# EAGLE design ADE-25_13cm (EAGLE 9.6.2)
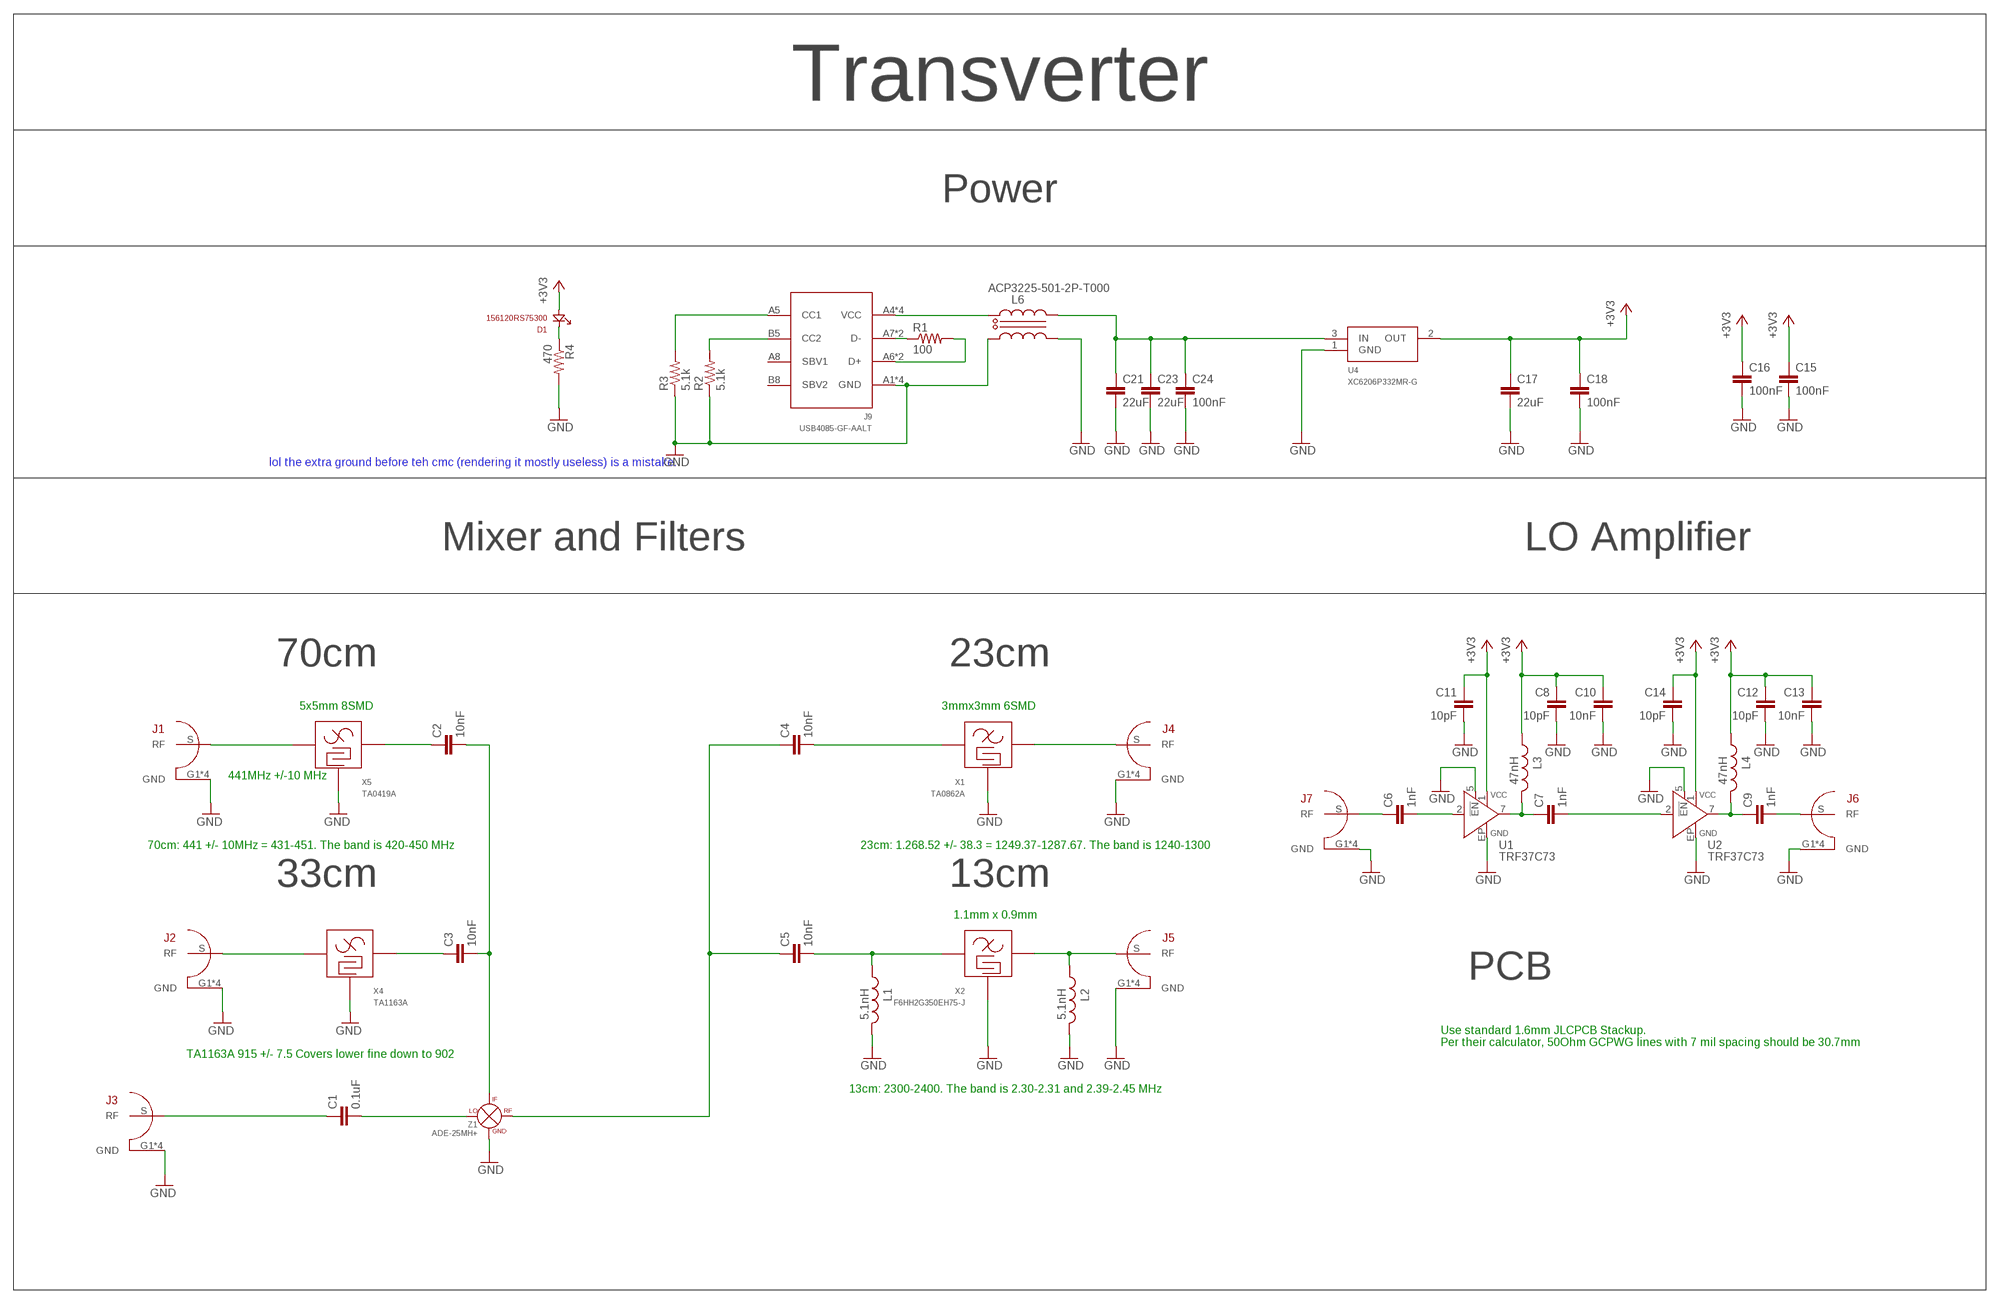
[diagram p0: schematic, sheet 1]

## Parts
C1  0.1uF  0603_CAPACITOR  [0603]
C2  10nF  0603_CAPACITOR  [0603]
C3  10nF  0603_CAPACITOR  [0603]
C4  10nF  0603_CAPACITOR  [0603]
C5  10nF  0603_CAPACITOR  [0603]
C6  1nF  0603_CAPACITOR  [0603]
C7  1nF  0603_CAPACITOR  [0603]
C8  10pF  0402_CAPACITOR  [0402_INDUCTOR]
C9  1nF  0603_CAPACITOR  [0603]
C10  10nF  0402_CAPACITOR  [0402_INDUCTOR]
C11  10pF  0402_CAPACITOR  [0402_INDUCTOR]
C12  10pF  0402_CAPACITOR  [0402_INDUCTOR]
C13  10nF  0402_CAPACITOR  [0402_INDUCTOR]
C14  10pF  0402_CAPACITOR  [0402_INDUCTOR]
C15  100nF  0603_CAPACITOR  [0603]
C16  100nF  0603_CAPACITOR  [0603]
C17  22uF  C-EUC1206  [C1206]
C18  100nF  0603_CAPACITOR  [0603]
C21  22uF  C-EUC1206  [C1206]
C23  22uF  C-EUC1206  [C1206]
C24  100nF  0603_CAPACITOR  [0603]
D1  156120RS75300  [1206_REV]
J1  0733910070  [CONREVSMA008-G]
J2  0733910070  [CONREVSMA008-G]
J3  0733910070  [CONREVSMA008-G]
J4  0733910070  [CONREVSMA008-G]
J5  0733910070  [CONREVSMA008-G]
J6  0733910070  [CONREVSMA008-G]
J7  0733910070  [CONREVSMA008-G]
J9  USB4085-GF-AALT  [USBC2]
L1  5.1nH  0402_INDUCTOR  [0402_INDUCTOR]
L2  5.1nH  0402_INDUCTOR  [0402_INDUCTOR]
L3  47nH  0402_INDUCTOR  [0402_INDUCTOR]
L4  47nH  0402_INDUCTOR  [0402_INDUCTOR]
L6  ACP3225-501-2P-T000  [3225]
R1  100  0603_RESISTOR  [0603]
R2  5.1k  0603_RESISTOR  [0603]
R3  5.1k  0603_RESISTOR  [0603]
R4  470  0603_RESISTOR  [0603]
U1  TRF37C73  [8WSON2X2]
U2  TRF37C73  [8WSON2X2]
U4  XC6206P332MR-G  [SOT23-3_CENTERED]
X1  TA0862A  [TA0862A]
X2  F6HH2G350EH75-J  [EH75]
X4  TA1163A  TA0862A  [TA0862A]
X5  TA0419A  [TAO419]
Z1  ADE-25MH+  [CD]

## Nets
1I: C4.2 X1.B
1O: J4.S(RF) X1.E
2I: C5.2 L1.P$1 X2.1
2O: J5.S(RF) L2.P$1 X2.4
70BI: C3.1 X4.B
70BO: J2.S(RF) X4.E
+3V3: C8.P$1 C10.P$1 C11.P$1 C12.P$1 C13.P$1 C14.P$1 C15.1 C16.1 C17.1 C18.1 D1.A L3.P$1 L4.P$1 U1.1(+VS) U2.1(+VS) U4.2(OUT)
+5V1: C21.1 C23.1 C24.1 L6.4(1OUT) U4.3(IN)
GND: C8.P$2 C10.P$2 C11.P$2 C12.P$2 C13.P$2 C14.P$2 C15.2 C16.2 C17.2 C18.2 C21.2 C23.2 C24.2 J1.G1(GND) J1.G2(GND) J1.G3(GND) J1.G4(GND) J2.G1(GND) J2.G2(GND) J2.G3(GND) J2.G4(GND) J3.G1(GND) J3.G2(GND) J3.G3(GND) J3.G4(GND) J4.G1(GND) J4.G2(GND) J4.G3(GND) J4.G4(GND) J5.G1(GND) J5.G2(GND) J5.G3(GND) J5.G4(GND) J6.G1(GND) J6.G2(GND) J6.G3(GND) J6.G4(GND) J7.G1(GND) J7.G2(GND) J7.G3(GND) J7.G4(GND) J9.A1(GND) J9.A12(GND) J9.B1(GND) J9.B12(GND) L1.P$2 L2.P$2 L6.2(2IN) L6.3(2OUT) R2.1 R3.1 R4.2 U1.5(!EN) U1.EP(-VS) U2.5(!EN) U2.EP(-VS) U4.1(GND) X1.A(GND) X1.C(GND) X1.D(GND) X1.F(GND) X2.2(GND) X2.3(GND) X2.5(GND) X4.A(GND) X4.C(GND) X4.D(GND) X4.F(GND) X5.1(GND) X5.3(GND) X5.4(GND) X5.5(GND) X5.7(GND) X5.8(GND) Z1.1(GND) Z1.4(GND) Z1.5(GND)
IN1: C6.2 U1.2(IN)
IN2: C7.2 U2.2(IN)
N$1: C1.1 J3.S(RF)
N$2: C1.2 Z1.6(LO)
N$3: C2.1 X5.2
N$4: C2.2 C3.2 Z1.2(IF)
N$5: C4.1 C5.1 Z1.3(RF)
N$7: J9.A7(D-) J9.B7(D-) R1.1
N$8: J9.A6(D+) J9.B6(D+) R1.2
N$10: J9.B5(CC2) R2.2
N$11: J9.A5(CC1) R3.2
N$13: D1.K R4.1
N$15: J9.A4(VCC) J9.A9(VCC) J9.B4(VCC) J9.B9(VCC) L6.1(1IN)
N$17: C6.1 J7.S(RF)
N$18: C9.2 J6.S(RF)
N$21: J1.S(RF) X5.6
OUT1: C7.1 L3.P$2 U1.7(OUT)
OUT2: C9.1 L4.P$2 U2.7(OUT)
Unconnected: J9.A8(SBV1) J9.B8(SBV2)

## Notes on the sheet
- Transverter
- Power
- lol the extra ground before teh cmc (rendering it mostly useless) is a mistake.
- Mixer and Filters | LO Amplifier
- 70cm | 23cm
- 5x5mm 8SMD | 3mmx3mm 6SMD
- 441MHz +/-10 MHz
- 70cm: 441 +/- 10MHz = 431-451. The band is 420-450 MHz | 23cm: 1.268.52 +/- 38.3 = 1249.37-1287.67. The band is 1240-1300
- 33cm | 13cm
- 1.1mm x 0.9mm
- PCB
- Use standard 1.6mm JLCPCB Stackup.
  Per their calculator, 50Ohm GCPWG lines with 7 mil spacing should be 30.7mm
- TA1163A 915 +/- 7.5 Covers lower fine down to 902
- 13cm: 2300-2400. The band is 2.30-2.31 and 2.39-2.45 MHz

## Library data of the parts
C1-C7 C9 C15 C16 C18 C24 = ruark2:0603_CAPACITOR: 0603 Capacitor -- WARNING: NO DEFINED VALUE OR PART NUMBER; VALUE: sel
C8 C10-C14 = ruark2:0402_CAPACITOR: 0402 select capacitor; VALUE: sel
C17 C21 C23 = rcl:C-EU: CAPACITOR, European symbol; SPICEPREFIX: C
D1 = ruark2:156120RS75300: Red 624nm LED Indication - Discrete 2V 1206 Reverse Mount (3216 Metric); PARTNO: 732-5031-1-ND
J1-J7 = ruark2:0733910070: SMA Connector Receptacle, Female Socket 50Ohm Through Hole Solder; PARTNO: WM5544-ND
J9 = ruark2:USB4085-GF-A: USB - C USB 2.0 Receptacle Connector 16 Position Through Hole, Right Angle
L1-L4 = ruark2:0402_INDUCTOR: select; VALUE: SEL
L6 = ruark2:ACP3225-501-2P-T000: 2 Line Common Mode Choke Surface Mount 500 Ohms @ 100 MHz 2A DCR 40mOhm (Typ); PARTNO: 445-172408-1-ND
R1-R4 = ruark2:0603_RESISTOR: 0603 Resistor -- WARNING: NO DEFINED PART NUMBER OR VALUE; VALUE: sel
U1 U2 = TRF37C73:TRF37C73
U4 = ruark2:XC6206P332MR-G: 200mA Fixed 3.3V Positive electrode 6V SOT-23-3L Voltage Regulators - Linear, Low Drop Out (LDO) Regulators ROHS; JLC: C5446
X1 X4 = ruark2:TA0862A: 1.26852GHz Frequency Wireless RF SAW Filter (Surface Acoustic Wave) 3.2dB 20.46MHz Bandwidth 6-SMD, No Lead; PARTNO: 4606-TA0862ACT-ND
X2 = ruark2:F6HH2G350EH75-J: 2.35GHz Frequency LTE, SCDMA RF SAW Filter (Surface Acoustic Wave) 1.4dB Bandwidth 5-SMD, No Lead; PARTNO: 587-F6HH2G350EH75-JCT-ND
X5 = ruark2:TA0419A: 441MHz Frequency General Purpose RF SAW Filter (Surface Acoustic Wave) 1.5dB 19MHz Bandwidth 8-SMD, No Lead; PARTNO: 4606-TA0419ACT-ND
Z1 = ruark2:ADE-25MH+: SMT Triple Balanced Mixer, RF/LO Freq 5 - 2500 MHz; PARTNO: 3157-ADE-25MH+CT-ND

## Board
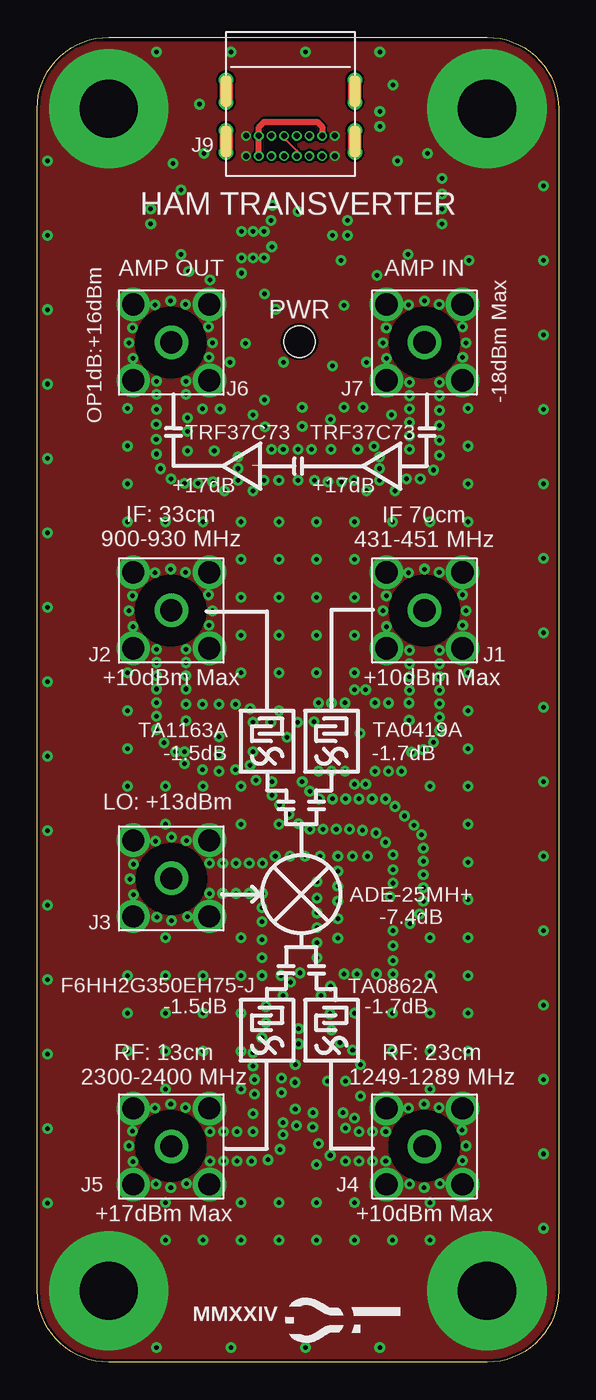
[diagram p1: board, top side]
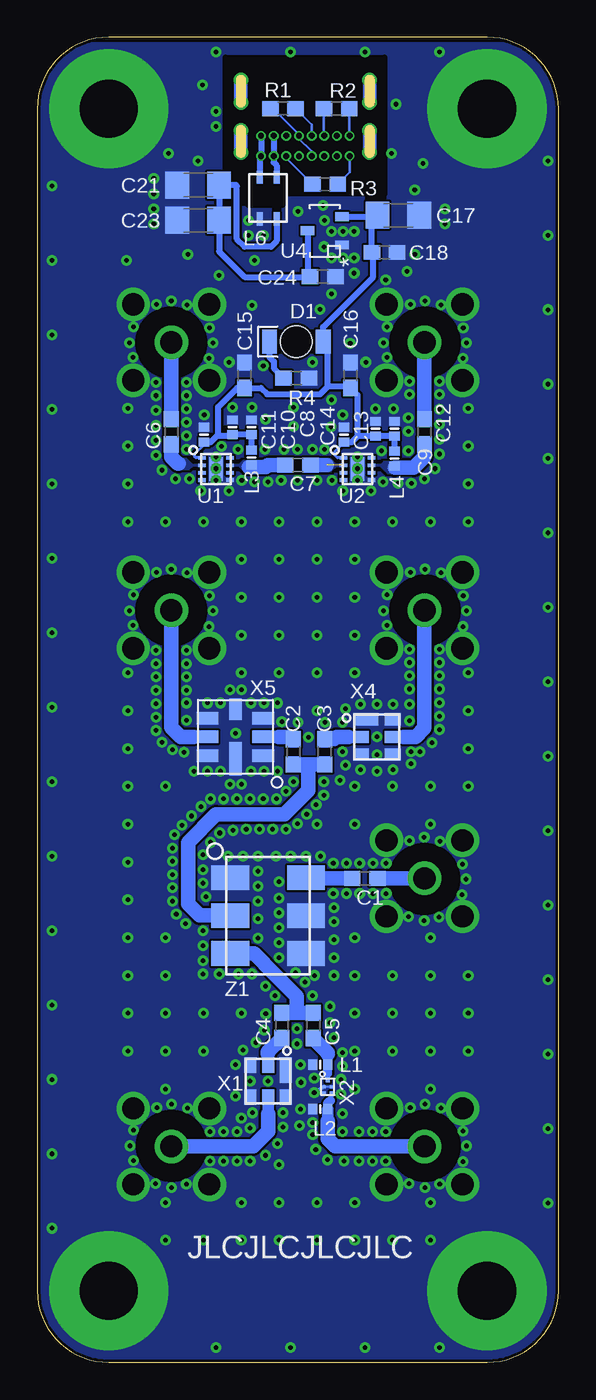
[diagram p2: board, bottom side, seen from below]

Size 35 x 89 mm. Coordinates in mm from the lower left corner, seen from the top.
Outline: 30.2,0 4.8,0 arc-90 0,4.8 0,84.2 arc-90 4.8,89 30.2,89 arc-90 35,84.2 35,4.8 arc-90 30.2,0
Copper layers (1*16): Top 0.035mm / dielectric 1.5mm / Bottom 0.035mm
Design rules "default *": minimum track width 5mil, minimum drill 12mil, track to track 6mil, track to pad 6mil, pad to pad 6mil, via to via 6mil, smd to smd 6mil, copper to edge 0.2mm, drill to drill 6mil, minimum pad ring 5mil, minimum via ring 8mil, stop-mask expansion 4mil, vias tented up to drill 12mil, thermal gap 10mil
tRestrict: area 23.7,48.2 to 28.3,52.8; area 6.7,48.2 to 11.2,52.8; area 6.7,30.2 to 11.3,34.7; area 6.7,12.3 to 11.3,16.8; area 23.7,12.3 to 28.3,16.8; area 6.7,12.3 to 11.3,16.8; area 23.7,66.2 to 28.3,70.8; area 6.7,66.2 to 11.2,70.8
bRestrict: area 23.7,48.2 to 28.3,52.8; area 6.7,48.2 to 11.2,52.8; area 6.7,30.2 to 11.3,34.7; area 6.7,12.3 to 11.3,16.8; area 23.7,12.3 to 28.3,16.8; area 6.7,12.3 to 11.3,16.8; area 23.7,66.2 to 28.3,70.8; area 6.7,66.2 to 11.2,70.8; area 17.2,40.8 to 18.4,41.2; area 15.1,40.8 to 16.3,41.2; area 18,22.4 to 19.2,22.8; area 15.9,22.4 to 17.1,22.8; 3 more areas

### Footprints (pad centres in the part's own frame; a part is rotated, then mirrored left to right if it is on the bottom)
0603 = smd 1.1 x 1: 1 -0.85,0; 2 0.85,0
0402_INDUCTOR = smd 0.6 x 0.7: P$1 0.5,0; P$2 -0.5,0
C1206 = smd 1.6 x 1.8: 1 -1.4,0; 2 1.4,0
1206_REV = smd 1 x 1.6: A -1.8,0; K 1.8,0 | hole 2.1: 0,0
CONREVSMA008-G = drill 1.499: G1 -2.553,2.553; G2 2.553,2.553; G3 2.553,-2.553; G4 -2.553,-2.553; S 0,0
USBC2 = drill 0.4 pad 0.65: A1 -2.975,0.98; A4 -2.125,0.98; A5 -1.275,0.98; A6 -0.425,0.98; A7 0.425,0.98; A8 1.275,0.98; A9 2.125,0.98; A12 2.975,0.98; B1 2.975,-0.37; B4 2.125,-0.37; B5 1.275,-0.37; B6 0.425,-0.37; B7 -0.425,-0.37; B8 -1.275,-0.37; B9 -2.125,-0.37; B12 -2.975,-0.37 | drill 0.65 pad 0.9: P$1 -4.325,0.75; P$2 4.325,0.75; P$3 4.325,-0.75; P$4 -4.325,-2.63; P$5 -4.325,-0.75; P$6 -4.325,-4.13; P$7 4.325,-2.63; P$8 4.325,-4.13
3225 = smd 0.9 x 0.4: 1 -1.4,0.575; 2 -1.4,-0.575; 3 1.4,-0.575; 4 1.4,0.575
8WSON2X2 = smd 0.5 x 0.25: 1 -0.95,0.75; 2 -0.95,0.25; 3 -0.95,-0.25; 4 -0.95,-0.75; 5 0.95,-0.75; 6 0.95,-0.25; 7 0.95,0.25; 8 0.95,0.75 | smd 0.9 x 1.6: EP 0,0
SOT23-3_CENTERED = smd 0.6 x 0.9: 1 -0.95,-1.15; 2 0.95,-1.15; 3 0,1.15
TA0862A = smd 0.81 x 1.7: A -1.191,-0.745 | smd 0.81 x 1.05: B 0,-1.07; C 1.19,-1.07; D 1.19,1.07; E 0,1.07; F -1.19,1.07
EH75 = smd 0.2 x 0.25: 1 -0.395,0; 2 0,-0.25; 3 0.395,-0.25; 4 0.395,0.25; 5 0,0.25
TAO419 = smd 0.84 x 1.47: 1 -1.27,-1.865; 2 0,-1.865; 3 1.27,-1.865; 5 1.27,1.865; 6 0,1.865; 7 -1.27,1.865 | smd 1.47 x 0.84: 4 1.865,0 | smd 2.28 x 0.84: 8 -1.46,0
CD = smd 1.651 x 2.54: 1 -2.54,-2.54; 2 0,-2.54; 3 2.54,-2.54; 4 2.54,2.54; 5 0,2.54; 6 -2.54,2.54

### Placement (x,y rotation side)
C1  13,32.5 180 bottom
C2  17.8,41 270 bottom
C3  15.7,41 270 bottom
C4  18.58,22.62 270 bottom
C5  16.48,22.62 270 bottom
C6  26,62.5 270 bottom
C7  17.5,60.25 0 bottom
C8  20.6,62.8 270 bottom
C9  9,62.5 90 bottom
C10  21.9,62.8 270 bottom
C11  23.8,62.3 270 bottom
C12  11,62.7 270 bottom
C13  12.3,62.7 270 bottom
C14  14.4,62.3 270 bottom
C15  21.08,66.29 90 bottom
C16  13.97,66.29 90 bottom
C17  10.76,77.04 0 bottom
C18  11.68,74.55 0 bottom
C21  24.19,79.07 180 bottom
C23  24.19,76.71 180 bottom
C24  15.83,72.92 0 bottom
D1  17.61,68.55 180 bottom
J1  26,50.5 270 top
J2  9,50.5 270 top
J3  9,32.5 0 top
J4  26,14.5 180 top
J5  9,14.5 180 top
J6  9,68.5 180 top
J7  26,68.5 180 top
J9  17,82 180 top
L1  16,20 0 bottom
L2  16,17 0 bottom
L3  20.6,60.77 90 bottom
L4  11,60.7 90 bottom
L6  19.5,78.2 270 bottom
R1  18.5,84.2 0 bottom
R2  14.9,84.2 180 bottom
R3  15.67,79.12 180 bottom
R4  17.61,66.1 0 bottom
U1  23,60 0 bottom
U2  13.5,60 0 bottom
U4  15.7,76 90 bottom
X1  19.5,18.88 180 bottom
X2  15.5,18.5 270 bottom
X4  12.2,42 270 bottom
X5  21.7,42 90 bottom
Z1  19.5,30 270 bottom

### Tracks (layer width: path | path; a pad name or v marks a point on that pad's centre or on a via)
1I
  Bottom 0.254: X1.B 19.5,20.83 19.51,20.84
  Bottom 0.965: C4.2 19.51,20.84 19.51,20.7
1O
  Bottom 0.78: 19.5,16.7 X1.E
  Bottom 0.965: J4.S 20.5,14.5 19.5,15.5 19.5,16.7
2I
  Bottom 0.2: X2.1 15.5,19.4
  Bottom 0.254: L1.P$1 15.5,20.72
  Bottom 0.6: 15.5,19.4 L1.P$1
  Bottom 0.965: C5.2 15.5,20.79 15.5,20.72 15.49,20.71
2O
  Bottom 0.2: X2.4 15.25,17.84 15.25,17.65
  Bottom 0.254: 15.25,17.84 15.5,17.4
  Bottom 0.6: L2.P$1 15.5,17.4 15.32,17.58
  Bottom 0.78: 15.5,16.2 L2.P$1
  Bottom 0.965: J5.S 15,14.5 15.5,15 15.5,16.08 | 15.5,16.08 15.49,16.09 | 15.5,16.08 15.5,16.2
70BI
  Bottom 0.78: 15.55,42 C3.1
  Bottom 0.8: 14.1,42 X4.B
  Bottom 0.965: C3.1 15.05,41.85 14.9,42 14.1,42
70BO
  Bottom 0.78: 10.4,42 X4.E
  Bottom 0.965: J2.S 9,42.6 9.6,42 10.4,42
+3V3
  Bottom 0.2: U1.1 24.35,60.75 24.43,60.83 24.43,61.02 23.8,61.65 C11.P$1 | U2.1 14.85,60.75 15,60.9 15,61.2 C14.P$1
  Bottom 0.406: C11.P$1 23.35,61.8 22.91,62.24 | 22.91,62.24 21.96,62.24 C10.P$1 C8.P$1 L3.P$1 | L4.P$1 C12.P$1 C13.P$1 13.49,62.2 | C14.P$1 13.89,61.8 13.49,62.2 | 22.91,62.24 22.86,62.29 22.86,64.16 21.57,65.44 C15.1 19.98,65.44 19.56,65.02 16,65.02 15.49,65.53 | U4.2 12.7,76.95 | 12.7,76.95 12.25,76.95 C17.1 | 12.7,76.95 12.53,76.78 C18.1 12.45,74.46 12.45,72.9 15.81,69.54 D1.A 15.49,68.24 15.49,65.53 | 13.49,62.2 13.49,64.97 C16.1 14.06,65.53 15.49,65.53
+5V1
  Bottom 0.406: L6.4 18.93,75.31 19.3,74.93 21.08,74.93 21.59,75.44 21.59,78.99 21.66,79.07 C21.1 C23.1 22.79,74.61 21.08,72.9 16.7,72.9 C24.1 16.85,73.08 U4.3
GND  (via drill 0.3, 3.9 pad 8)
  Bottom 0.127: X2.5 X2.2
  Bottom 0.152: R3.1 14.03,79.92 J9.A12 | R2.1 14.05,82.39 J9.B1
  Bottom 0.254: X2.2 v16.4,18.1
  Bottom 0.406: J9.B12 J9.A1 20.07,80.92 L6.2
  other vias: 28.8,50.48 28.57,49.49 28.54,51.55 27.02,47.82 27.02,46.93 24.99,47.82 24.99,46.93 26,53.28 26.99,53.05 24.94,53.02 23.21,50.48 23.44,51.47 23.46,49.42 25.15,40.98 24.98,43.12 21.67,42.25 24.97,44.28 22.69,44.28 23.58,44.28 23.58,39.71 22.69,39.71 24.47,39.71 18.88,39.71 20.66,39.71 19.77,39.71 19.77,44.28 20.66,44.28 18.88,44.28 21.29,38.82 22.05,38.82 21.29,45.17 22.05,45.17 11.76,50.48 11.53,49.49 11.5,51.55 10,47.9 10,47 8,47.9 8,47 8.96,53.28 9.95,53.05 7.9,53.02 6.17,50.48 6.4,51.47 6.42,49.42 9.3,41 10,43.1 9.9,41 10,44.2 11.1,44.2 12.2,44.2 13.3,44.2 9.9,40.2 11.1,39.8 12.2,40.8 13.3,39.8 14.5,43 14.5,41 14.3,40.1 14.3,43.9 9.02,35.26 10.01,35.03 7.95,35 6.22,32.46 6.45,33.45 6.48,31.4 9.02,29.67 8.03,29.9 10.08,29.92 25.98,11.74 24.99,11.97 27.05,12 23.4,13.5 22.5,13.5 23.4,15.5 22.5,15.5 28.78,14.54 28.55,13.55 28.52,15.6 25.98,17.33 26.97,17.1 24.92,17.08 20.7,13.5 21.6,13.5 21.6,15.5 20.7,15.73 8.96,17.33 9.96,17.1 7.9,17.08 11.6,15.5 12.5,15.5 11.6,13.5 12.5,13.5 6.17,14.54 6.4,15.53 6.42,13.47 8.96,11.74 7.97,11.97 10.03,12 13.4,15.5 13.4,13.5 16.5,15.3 14.5,20.8 16.5,16.1 14.5,15.5 17.33,20 16.4,19.1 17.32,17 14.5,19.9 14.6,19 14.6,18 14.5,16.7 4.8,4.8 30.2,4.8 30.2,84.2 4.8,84.2 0.7,80.7 0.7,75.7 0.7,70.7 0.7,65.7 0.7,60.7 0.7,55.7 0.7,50.7 0.7,45.7 0.7,40.7 0.7,35.7 0.7,30.7 0.7,25.7 0.7,20.7 0.7,15.7 0.7,10.7 15.7,76.7 20.83,76.7 8,1 34,9 13,1 18,1 23,1 34,14 34,19 34,24 34,29 34,34 34,39 34,44 34,49 34,54 34,59 34,64 34,69 34,79 34,74 8,88 23,84 27.02,44.24 27.02,43.34 27.02,42.44 26.62,41.64 25.92,41.14 18.58,43.01 16.78,41.98 17.48,42.98 15.68,42.98 14.68,39.08 8,44.3 8,43.4 8,42.5 8.5,41.6 12.2,39.7 23.68,31.28 23.88,32.18 21.85,35.72 22.18,33.98 21.18,33.98 20.18,33.98 18.98,33.98 17.98,33.98 23.88,28.98 23.88,27.98 23.88,26.98 23.88,26.08 22.78,26.08 21.48,26.08 18.78,27.18 18.78,28.18 18.78,29.18 18.78,30.18 18.78,31.18 18.78,32.28 20.18,32.98 20.18,31.98 20.18,30.98 20.18,29.78 20.18,28.48 15.98,33.98 15.08,30.53 15.08,29.58 15.08,28.38 15.08,27.18 15.08,25.98 16.38,25.98 15.36,23.9 17.56,22.4 15.36,22.8 19.05,24.63 19.66,23.4 19.76,22.3 19.67,13.9 18.87,14.7 18.5,15.8 19.5,18.88 20.7,18.88 21.3,16.4 21.7,17.88 21.7,19.98 21.19,20.98 17.3,18.8 17.4,15.9 14.4,13.5 15.5,13.6 16.3,14.3 12.2,42.02 28.8,68.48 28.57,67.49 28.54,69.55 27.02,65.82 27.02,64.93 24.99,65.82 24.99,64.93 26,71.28 26.99,71.05 24.94,71.02 23.21,68.48 23.44,69.47 23.46,67.42 11.76,68.48 11.53,67.49 11.5,69.55 10,65.9 10,65 8,65.9 8,65 8.96,71.28 9.95,71.05 7.9,71.02 6.17,68.48 6.4,69.47 6.42,67.42 11.2,81.2 26.2,81.2 22.99,60.03 22.99,59.23 22.99,60.83 24.79,59.33 24.99,61.33 24.99,64.03 24.99,63.13 24.99,62.23 23.79,63.63 21.89,64.13 20.59,64.13 19.69,63.33 15.29,62.83 14.49,63.63 12.29,64.03 11.09,64.03 10.09,62.53 10.09,63.43 9.65,78.74 9.11,80.51 24.89,74.42 13,88 18,88 23,88 29,74 23,83 19.81,75.69 20.83,75.69 15.24,74.17 13.72,74.17 14.48,74.17 13.72,75.95 14.48,75.95 15.24,75.95 15.75,74.93 13.72,73.15 7.62,77.47 7.62,76.45 9.65,74.42 27.18,79.5 27.18,78.49 27.18,77.47 27.18,76.45 24.2,80.7 22.8,73 20.4,74 17.5,77.3 15.8,77.7 11.6,72.7 23.9,85.8 10.9,84.5 27.02,63.93 27.02,62.93 27.02,61.93 27.02,60.93 8,64 7.99,63 7.99,62 8,61 26.62,59.93 25.72,59.33 21.27,59.23 21.52,61.33 22.62,61.53 22.12,58.53 24.02,58.53 20.42,59.13 19.52,59.13 17.52,59.23 18.62,59.23 16.22,59.23 17.52,61.33 18.42,61.33 19.72,61.33 16.52,61.33 15.72,61.33 15.22,59.23 13.49,60.03 13.49,59.23 13.49,60.83 11.79,59.13 12.59,58.53 14.49,58.53 10.79,59.03 9.89,59.03 8.99,59.33 8.29,60.03 10.09,61.23 11.89,61.23 22.11,67.17 19.82,66.92 13.98,68.44 12.94,67.17 16.52,67.17 28.92,59 28.92,61.54 28.92,64.08 28.92,56.46 26.38,56.46 23.84,56.46 21.3,56.46 18.76,56.46 16.22,56.46 13.68,56.46 11.14,56.46 8.6,56.46 6.06,56.46 6.06,59 6.06,61.54 6.06,64.08 13.68,53.92 16.22,53.92 18.76,53.92 21.3,53.92 17.79,64.13 15.25,64.64 17.79,62.86 16.01,70.73 20.59,70.98 15.25,71.75 10.17,73.27 17.79,38.98 18.3,38.35 18.93,37.84 19.82,37.84 20.71,37.84 21.6,37.84 22.49,37.84 15.76,38.98 15.76,38.09 16.27,37.46 16.9,36.82 17.54,36.19 18.3,35.81 19.19,35.81 20.08,35.81 23.38,37.84 20.97,35.81 22.75,35.55 23.38,34.92 25.03,29.46 12.46,33.52 15.12,33.52 14.24,33.52 15.12,31.49 14.24,31.49 12.46,31.49 11.57,31.49 11.57,33.52 27.02,46.04 27.02,45.15 24.99,46.04 24.99,45.15 10,46.11 10,45.22 8,46.11 8,45.22 13.35,33.52 13.35,31.49 16.96,33.98 20.59,26.08 17.56,21.39 20.54,16.76 18.51,16.76 23.88,33.07 23.88,34.09 24.02,37.33 24.65,36.7 25.29,36.06 25.79,35.42 25.92,34.54 25.92,33.65 25.92,32.76 25.92,31.87 25.92,30.98 25.67,30.09 19.68,25.27 17.65,26.15 17.02,25.52 16.51,24.63 21.3,51.38 21.3,48.84 21.3,46.3 18.76,46.3 16.22,46.3 16.22,43.76 13.68,46.3 13.68,48.84 13.68,51.38 16.22,51.38 18.76,51.38 18.76,48.84 16.22,48.84 13.68,38.68 13.68,36.14 16.22,36.14 11.14,38.68 8.6,38.68 6.06,38.68 6.06,41.22 6.06,43.76 6.06,46.3 28.92,43.76 28.92,46.3 28.92,41.22 28.92,38.68 28.92,36.14 26.38,38.68 28.92,33.6 28.92,31.06 28.92,28.52 28.92,25.98 26.38,25.98 26.38,28.52 28.92,23.44 28.92,20.9 26.38,20.9 26.38,23.44 23.84,23.44 21.3,23.44 23.84,20.9 26.38,18.36 13.68,23.44 13.68,25.98 13.68,28.52 11.14,25.98 8.6,25.98 6.06,25.98 8.6,28.52 11.14,23.44 11.14,20.9 8.6,18.36 8.6,20.9 8.6,23.44 6.06,23.44 6.06,20.9 13.68,20.9 13.68,18.36 13.68,10.74 16.22,10.74 18.76,10.74 21.3,10.74 18.76,13.28 26.38,10.74 8.6,10.74 8.6,8.2 13.68,8.2 11.14,8.2 16.22,8.2 18.76,8.2 21.3,8.2 23.84,8.2 26.38,8.2 8.6,36.14 15.08,21.81 20.32,21.49
  pour Top (rank 5, no thermals): 35,0 35,88.56 0.06,88.56 0.06,0
  pour Bottom (rank 4, no thermals): 35,0 35,88.56 0.06,88.56 0.06,0
IN1
  Bottom 0.965: C6.2 26,60.8 25.55,60.35 25.51,60.35
  pour Bottom (no thermals): 23.8,60.2 24.6,60.2 24.85,59.95 25.55,59.95 25.55,60.7 25,60.7 24.6,60.3 23.8,60.3
IN2  (1 unrouted)
  Bottom 0.965: C7.2 15.58,60.25
  pour Bottom (no thermals): 14.3,60.3 14.95,60.3 15.3,60.65 15.45,60.65 15.45,59.85 15.28,59.85 14.93,60.2 14.3,60.2
N$1
  Bottom 0.965: J3.S C1.1
N$2
  Bottom 0.78: C1.2 13.89,32.54
  Bottom 0.965: C1.2 16.92,32.5 Z1.6
N$3
  Bottom 0.8: X5.2 18.8,42
  Bottom 0.965: 18.8,42 17.95,42 C2.1
N$4
  Bottom 0.965: C2.2 16.8,40.15 | 16.8,40.15 C3.2 | 16.8,40.15 16.8,38.4 18.4,36.8 23,36.8 24.87,34.93 24.87,30.77 24.1,30 Z1.2
N$5
  Bottom 0.965: Z1.3 20.43,27.46 19.77,26.8 19.77,26.77 17.58,24.58 17.58,23.47 | C5.1 17.58,23.47 | 17.58,23.47 C4.1
N$7
  Bottom 0.152: R1.1 19.15,84.2 17.43,82.47 J9.B7 17.43,82.19 16.57,81.34 J9.A7
N$8
  Top 0.152: J9.A6 17.43,81.38 16.57,82.23 J9.B6
  Bottom 0.152: R1.2 16.57,83.12 J9.B6
N$10
  Bottom 0.152: J9.B5 15.72,82.39 15.75,82.41 R2.2
N$11
  Bottom 0.152: J9.A5 18.27,80.87 R3.2
N$13
  Bottom 0.406: D1.K 19.41,67.51 19.11,67.22 19.11,66.75 R4.1
N$15
  Top 0.406: J9.A9 J9.B4 14.88,82.95 15.24,83.31 18.8,83.31 19.12,82.98 J9.B9
  Bottom 0.406: J9.B9 J9.A4 19.12,80.59 18.93,80.39 L6.1
N$17
  Bottom 0.965: J7.S C6.1
N$18
  Bottom 0.965: J6.S C9.2
N$21
  Bottom 0.78: 24.5,42 X5.6
  Bottom 0.965: 24.5,42 25.35,42 26,42.65 J1.S
NAN1
  cutout Bottom: 22.35,87.63 11.68,87.63 11.68,78.49 18.54,78.49 18.54,77.72 20.83,77.72 22.35,79.25
OUT1
  Bottom 0.965: C7.1 19.53,60.25 19.65,60.13 20.78,60.13
  pour Bottom (no thermals): 22.22,60.3 21.42,60.3 21.17,60.55 20.47,60.55 20.47,59.8 21.02,59.8 21.42,60.2 22.22,60.2
OUT2
  Bottom 0.965: C9.1 9,60.8 9.71,60.09 11,60.09
  pour Bottom (no thermals): 12.73,60.3 11.9,60.3 11.7,60.5 10.98,60.5 10.98,59.7 11.42,59.7 11.93,60.2 12.73,60.2

### Text on the board
tPlace: HAM TRANSVERTER | AMP OUT | AMP IN | PWR | -18dBm Max | OP1dB:+16dBm | TRF37C73 | TRF37C73 | +17dB | +17dB | IF: 33cm / 900-930 MHz | IF 70cm / 431-451 MHz | +10dBm Max | +10dBm Max | TA0419A | TA1163A | -1.5dB | -1.7dB | LO: +13dBm | ADE-25MH+ | -7.4dB | F6HH2G350EH75-J | TA0862A | -1.5dB | -1.7dB | RF: 13cm / 2300-2400 MHz | RF: 23cm / 1249-1289 MHz | +17dBm Max | +10dBm Max | MMXXIV
bNames: JLCJLCJLCJLC
tStop: 032